# EAGLE design mainboardv0.1 (EAGLE 6.5.0)
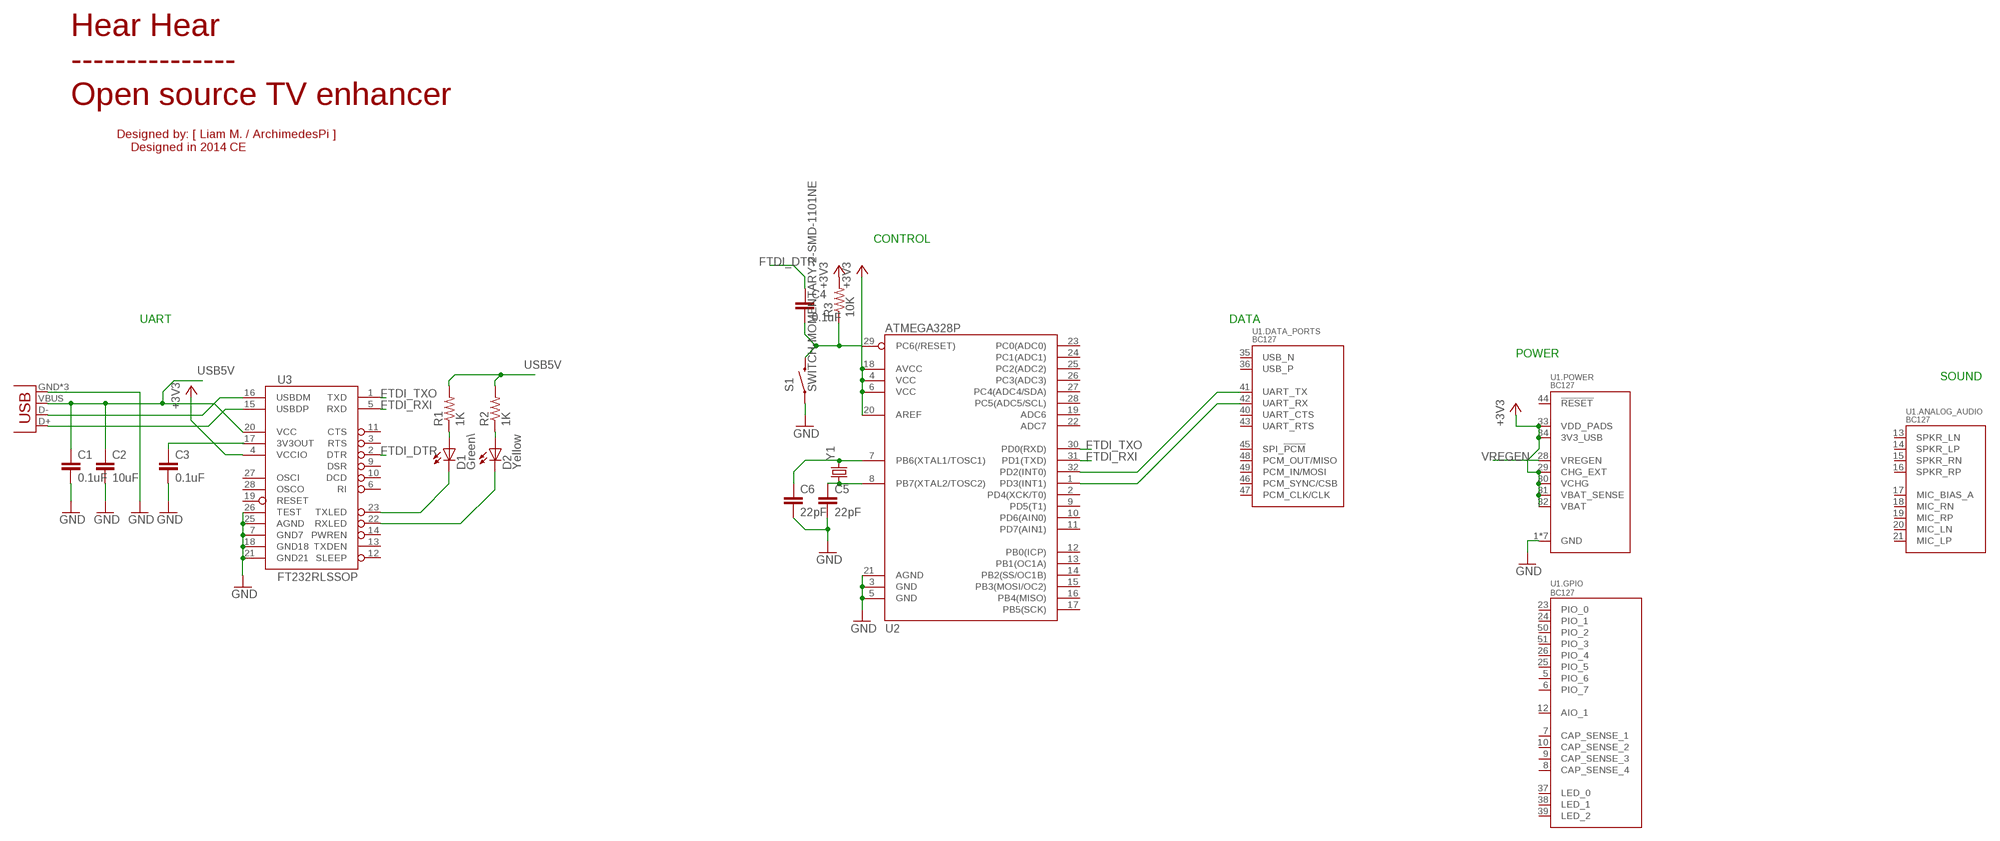
[diagram p0: schematic, sheet 1]

## Parts
C1  0.1uF  0.1UF-100V-10%(0603)  [0603-CAP]
C2  10uF  10UF-6.3V-20%(0603)  [0603-CAP]
C3  0.1uF  0.1UF-100V-10%(0603)  [0603-CAP]
C4  0.1uF  0.1UF-25V(+80/-20%)(0603)  [0603-CAP]
C5  22pF  22PF-50V-5%(0603)  [0603-CAP]
C6  22pF  22PF-50V-5%(0603)  [0603-CAP]
D1  Green\  LED-GREEN0603  [LED-0603]
D2  Yellow  LED-YELLOW0603  [LED-0603]
JP1  USB-MICROB  [USB-MICROB]
R1  1K  1KOHM1/10W1%(0603)  [0603-RES]
R2  1K  1KOHM1/10W1%(0603)  [0603-RES]
R3  10K  10KOHM1/10W1%(0603)0603  [0603-RES]
S1  SWITCH-MOMENTARY-2-SMD-1101NE  [TACTILE-SWITCH-1101NE]
U1  BC127  [BC127]
U2  ATMEGA328P  ATMEGA328_SMT  [TQFP32-08]
U3  FT232RLSSOP  [SSOP28DB]
Y1  CRYSTALHC49US  [HC49US]

## Nets
+3V3: R3.2 U1.29(.POWER:CHG_EXT) U1.30(.POWER:VCHG) U1.31(.POWER:VBAT_SENSE) U1.32(.POWER:VBAT) U1.33(.POWER:VDD_PADS) U1.34(.POWER:3V3_USB) U2.4(VCC) U2.6(VCC) U2.18(AVCC) U2.20(AREF) U3.4(VCCIO)
BC127_UART_RXI: U1.42(.DATA_PORTS:UART_RX) U2.1(PD3(INT1))
BC127_UART_TXO: U1.41(.DATA_PORTS:UART_TX) U2.32(PD2(INT0))
FTDI_DTR: C4.1 U3.2(DTR)
FTDI_RXI: U2.31(PD1(TXD)) U3.5(RXD)
FTDI_TXO: U2.30(PD0(RXD)) U3.1(TXD)
GND: C1.2 C2.2 C3.2 C5.2 C6.2 JP1.GND JP1.MT1(GND) JP1.MT2(GND) S1.P$1 U1.1(.POWER:GND) U1.2(.POWER:GND) U1.3(.POWER:GND) U1.4(.POWER:GND) U1.11(.POWER:GND) U1.22(.POWER:GND) U1.27(.POWER:GND) U2.3(GND) U2.5(GND) U2.21(AGND) U3.7(GND7) U3.18(GND18) U3.21(GND21) U3.25(AGND) U3.26(TEST)
N$1: JP1.D- U3.16(USBDM)
N$2: JP1.D+ U3.15(USBDP)
N$3: C4.2 R3.1 S1.P$2 U2.29(PC6(/RESET))
N$4: C3.1 U3.17(3V3OUT)
N$5: D1.A R1.1
N$6: D2.A R2.1
N$7: D1.C U3.23(TXLED)
N$8: D2.C U3.22(RXLED)
N$9: C6.1 U2.7(PB6(XTAL1/TOSC1)) Y1.2
N$10: C5.1 U2.8(PB7(XTAL2/TOSC2)) Y1.1
USB5V: C1.1 C2.1 JP1.VBUS R1.2 R2.2 U3.20(VCC)
VREGEN: U1.28(.POWER:VREGEN)
Unconnected: U1.5(.GPIO:PIO_6) U1.6(.GPIO:PIO_7) U1.7(.GPIO:CAP_SENSE_1) U1.8(.GPIO:CAP_SENSE_4) U1.9(.GPIO:CAP_SENSE_3) U1.10(.GPIO:CAP_SENSE_2) U1.12(.GPIO:AIO_1) U1.13(.ANALOG_AUDIO:SPKR_LN) U1.14(.ANALOG_AUDIO:SPKR_LP) U1.15(.ANALOG_AUDIO:SPKR_RN) U1.16(.ANALOG_AUDIO:SPKR_RP) U1.17(.ANALOG_AUDIO:MIC_BIAS_A) U1.18(.ANALOG_AUDIO:MIC_RN) U1.19(.ANALOG_AUDIO:MIC_RP) U1.20(.ANALOG_AUDIO:MIC_LN) U1.21(.ANALOG_AUDIO:MIC_LP) U1.23(.GPIO:PIO_0) U1.24(.GPIO:PIO_1) U1.25(.GPIO:PIO_5) U1.26(.GPIO:PIO_4) U1.35(.DATA_PORTS:USB_N) U1.36(.DATA_PORTS:USB_P) U1.37(.GPIO:LED_0) U1.38(.GPIO:LED_1) U1.39(.GPIO:LED_2) U1.40(.DATA_PORTS:UART_CTS) U1.43(.DATA_PORTS:UART_RTS) U1.44(.POWER:!RESET) U1.45(.DATA_PORTS:SPI_!PCM) U1.46(.DATA_PORTS:PCM_SYNC/CSB) U1.47(.DATA_PORTS:PCM_CLK/CLK) U1.48(.DATA_PORTS:PCM_OUT/MISO) U1.49(.DATA_PORTS:PCM_IN/MOSI) U1.50(.GPIO:PIO_2) U1.51(.GPIO:PIO_3) U2.2(PD4(XCK/T0)) U2.9(PD5(T1)) U2.10(PD6(AIN0)) U2.11(PD7(AIN1)) U2.12(PB0(ICP)) U2.13(PB1(OC1A)) U2.14(PB2(SS/OC1B)) U2.15(PB3(MOSI/OC2)) U2.16(PB4(MISO)) U2.17(PB5(SCK)) U2.19(ADC6) U2.22(ADC7) U2.23(PC0(ADC0)) U2.24(PC1(ADC1)) U2.25(PC2(ADC2)) U2.26(PC3(ADC3)) U2.27(PC4(ADC4/SDA)) U2.28(PC5(ADC5/SCL)) U3.3(RTS) U3.6(RI) U3.9(DSR) U3.10(DCD) U3.11(CTS) U3.12(SLEEP) U3.13(TXDEN) U3.14(PWREN) U3.19(RESET) U3.27(OSCI) U3.28(OSCO)

## Notes on the sheet
- Hear Hear
  ---------------
  Open source TV enhancer
- Designed by: [ Liam M. / ArchimedesPi ]
      Designed in 2014 CE
- CONTROL
- UART | DATA
- POWER
- SOUND

## Library data of the parts
C1 C3 = SparkFun-Capacitors:0.1UF-100V-10%(0603): CAP-08390; PROD_ID: CAP-08390
C2 = SparkFun-Capacitors:10UF-6.3V-20%(0603): CAP-11015; PROD_ID: CAP-11015
C4 = SparkFun-Capacitors:0.1UF-25V(+80/-20%)(0603): CAP-00810 Ceramic Standard decoupling cap; PROD_ID: CAP-00810
C5 C6 = SparkFun-Capacitors:22PF-50V-5%(0603): CAP-07876; PROD_ID: CAP-07876
D1 = SparkFun-LED:LED-GREEN: Various green LEDs Green LEDs used in SFE Production 0603- DIO-00821 LARGE- DIO-00862 LILYPAD- DIO-09910; PROD_ID: DIO-00821; VALUE: GREEN
D2 = SparkFun-LED:LED-YELLOW: Yellow SMD LEDs LilyPad 1206- DIO-09909 0603- DIO-09003; PROD_ID: DIO-09003
JP1 = SparkFun-Connectors:USB: USB Connectors USB-B-PTH is fully proven SKU : PRT-00139/CONN-08278 USB-miniB is fully proven SKU : PRT-00587 USB-A-PCB is untested. USB-A-H is throughly reviewed, but untested. Spark Fun Electronics SKU : PRT-00437 USB-B-SMT is throughly reviewed, but untested. Needs silkscreen touching up. USB-A-S has not been used/tested USB-MB-H has not been used/tested USB-MICROB has been used. CONN-09505; PROD_ID: CONN-09505
R1 R2 = SparkFun-Resistors:1KOHM1/10W1%(0603): RES-07856; PROD_ID: RES-07856
R3 = SparkFun-Resistors:10KOHM1/10W1%(0603): RES-00824; PROD_ID: RES-00824
S1 = SparkFun-Electromechanical:SWITCH-MOMENTARY-2: Various NO switches- pushbuttons, reed, etc
U1 = SparkFun-RF:BC127: Blue Creations BC127 BLE module Hyper-competent Bluetooth 4.0 module, with: - Pre-4.0 support - 4 Cap sense inputs - 1 Analog input - 8 GPIO - 3 Open-drain LED drivers - Onboard battery charge circuitry - SPP/UART support - PCM Audio support - SPI port - Built-in USB - All kinds of other crazy crap
U2 = SparkFun-DigitalIC:ATMEGA328_SMT: 32-Pin Atmega328 part Commonly used on Arduino compatible boards Available in QFP and QFN packages TQFP is IC-09069 QFN is non-stock; PROD_ID: IC-09069
U3 = SparkFun-DigitalIC:FT232RL: USB UART FT232RL 4th Generation USB UART (USB <-> Serial) Controller. Spark Fun Electronics SKU : COM-00650 Production SKU IC-00870; PROD_ID: IC-00870
Y1 = SparkFun-FreqCtrl:CRYSTAL: Various standard crystals. Proven footprints. Spark Fun Electronics SKU : COM-00534

## Board
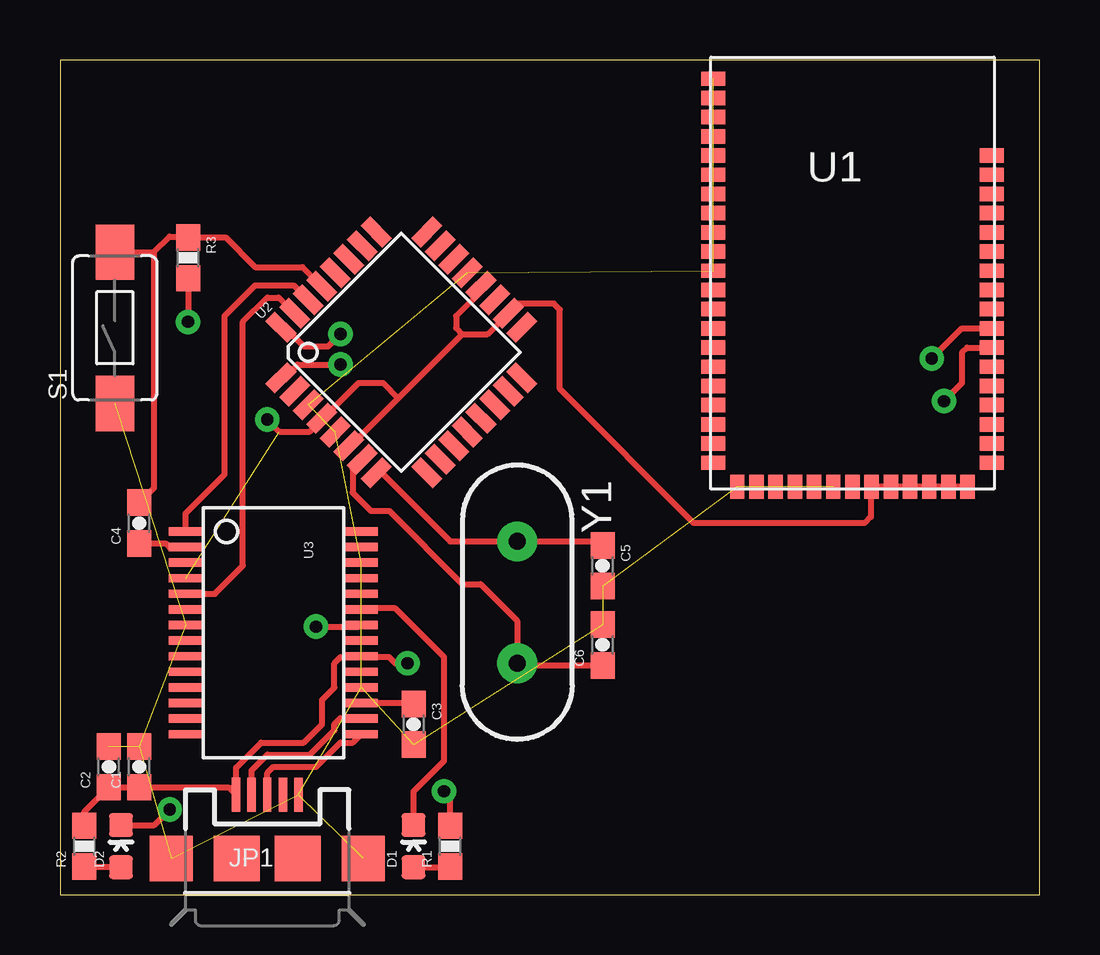
[diagram p1: board, top side]
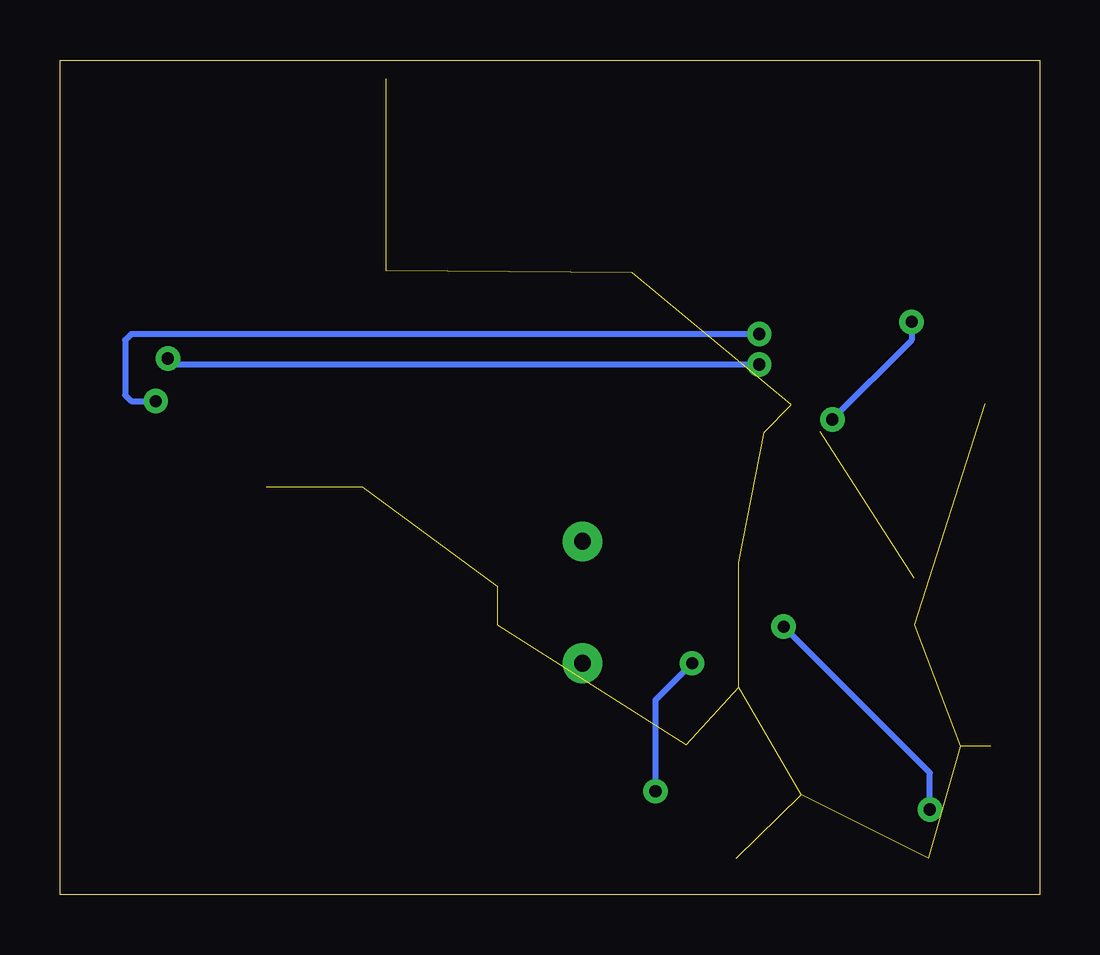
[diagram p2: board, bottom side, seen from below]

Size 40.82 x 34.79 mm. Coordinates in mm from the lower left corner, seen from the top.
Outline: 0,0 40.82,0 40.82,34.79 0,34.79 0,0
Copper layers (1*16): Top 0.035mm / dielectric 1.5mm / Bottom 0.035mm
Design rules "SparkFun-2-layer": minimum track width 7mil, minimum drill 15mil, track to track 8mil, track to pad 8mil, pad to pad 8mil, via to via 8mil, smd to smd 8mil, copper to edge 8mil, drill to drill 8mil, minimum pad ring 12mil, minimum via ring 10mil, stop-mask expansion 4mil, vias tented up to drill 20mil, thermal gap 10mil

### Footprints (pad centres in the part's own frame; a part is rotated, then mirrored left to right if it is on the bottom)
0603-CAP = smd 1.1 x 1: 1 -0.85,0; 2 0.85,0
LED-0603 = smd 1 x 1: A 0,-0.877; C 0,0.877
USB-MICROB = smd 0.35 x 1.4: D+ 0,2.65; D- -0.65,2.65; GND 1.3,2.65; ID 0.65,2.65; VBUS -1.3,2.65 | smd 1.8 x 1.9: MT1 -4,0; MT2 4,0 | smd 1.9 x 1.9: P$1 -1.27,0; P$2 1.27,0
0603-RES = smd 1.1 x 1: 1 -0.85,0; 2 0.85,0
TACTILE-SWITCH-1101NE = smd 2.3 x 1.6: P$1 -3.15,0; P$2 3.15,0
BC127 = smd 1 x 0.6: 1 -5.8,8.1; 2 -5.8,7.3; 3 -5.8,6.5; 4 -5.8,5.7; 5 -5.8,4.9; 6 -5.8,4.1; 7 -5.8,3.3; 8 -5.8,2.5; 9 -5.8,1.7; 10 -5.8,0.9; 11 -5.8,0.1; 12 -5.8,-0.7; 13 -5.8,-1.5; 14 -5.8,-2.3; 15 -5.8,-3.1; 16 -5.8,-3.9; 17 -5.8,-4.7; 18 -5.8,-5.5; 19 -5.8,-6.3; 20 -5.8,-7.1; 21 -5.8,-7.9; 35 5.8,-7.9; 36 5.8,-7.1; 37 5.8,-6.3; 38 5.8,-5.5; 39 5.8,-4.7; 40 5.8,-3.9; 41 5.8,-3.1; 42 5.8,-2.3; 43 5.8,-1.5; 44 5.8,-0.7; 45 5.8,0.1; 46 5.8,0.9; 47 5.8,1.7; 48 5.8,2.5; 49 5.8,3.3; 50 5.8,4.1; 51 5.8,4.9 | smd 0.6 x 1: 22 -4.8,-8.9; 23 -4,-8.9; 24 -3.2,-8.9; 25 -2.4,-8.9; 26 -1.6,-8.9; 27 -0.8,-8.9; 28 0,-8.9; 29 0.8,-8.9; 30 1.6,-8.9; 31 2.4,-8.9; 32 3.2,-8.9; 33 4,-8.9; 34 4.8,-8.9
TQFP32-08 = smd 1.27 x 0.559: 1 -4.293,2.8; 2 -4.293,2; 3 -4.293,1.2; 4 -4.293,0.4; 5 -4.293,-0.4; 6 -4.293,-1.2; 7 -4.293,-2; 8 -4.293,-2.8; 17 4.293,-2.8; 18 4.293,-2; 19 4.293,-1.2; 20 4.293,-0.4; 21 4.293,0.4; 22 4.293,1.2; 23 4.293,2; 24 4.293,2.8 | smd 0.559 x 1.27: 9 -2.8,-4.293; 10 -2,-4.293; 11 -1.2,-4.293; 12 -0.4,-4.293; 13 0.4,-4.293; 14 1.2,-4.293; 15 2,-4.293; 16 2.8,-4.293; 25 2.8,4.293; 26 2,4.293; 27 1.2,4.293; 28 0.4,4.293; 29 -0.4,4.293; 30 -1.2,4.293; 31 -2,4.293; 32 -2.8,4.293
SSOP28DB = smd 0.348 x 1.397: 1 -4.225,-3.656; 2 -3.575,-3.656; 3 -2.925,-3.656; 4 -2.275,-3.656; 5 -1.625,-3.656; 6 -0.975,-3.656; 7 -0.325,-3.656; 8 0.325,-3.656; 9 0.975,-3.656; 10 1.625,-3.656; 11 2.275,-3.656; 12 2.925,-3.656; 13 3.575,-3.656; 14 4.225,-3.656; 15 4.225,3.656; 16 3.575,3.656; 17 2.925,3.656; 18 2.275,3.656; 19 1.625,3.656; 20 0.975,3.656; 21 0.325,3.656; 22 -0.325,3.656; 23 -0.975,3.656; 24 -1.625,3.656; 25 -2.275,3.656; 26 -2.925,3.656; 27 -3.575,3.656; 28 -4.225,3.656
HC49US = drill 0.7 pad 1.651: 1 -2.54,0; 2 2.54,0

### Placement (x,y rotation side)
C1  3.3,5.33 90 top
C2  2.03,5.33 90 top
C3  14.73,7.11 270 top
C4  3.3,15.49 90 top
C5  22.61,13.72 270 top
C6  22.61,10.41 90 top
D1  14.73,2.03 0 top
D2  2.54,2.03 0 top
JP1  8.64,1.52 0 top
R1  16.26,2.03 90 top
R2  1.02,2.03 90 top
R3  5.33,26.54 270 top
S1  2.29,23.62 90 top
U1  33.02,25.91 0 top
U2  14.22,22.61 45 top
U3  8.89,10.92 270 top
Y1  19.05,12.19 270 top

### Tracks (layer width: path | path; a pad name or v marks a point on that pad's centre or on a via)
+3V3  (via drill 0.51)  (1 unrouted)
  Top 0.254: U1.34 U1.33 U1.32 U1.31 U1.30 U1.29 33.78,16.97 33.78,15.75 33.53,15.49 26.42,15.49 20.83,21.08 20.83,24.38 20.57,24.64 19.05,24.64 18.67,24.26 U2.18 17.81,23.37 16.76,23.37 | U2.6 12.12,18.72 14.1,20.7 | 14.1,20.7 16.76,23.37 | U2.20 17.54,25.16 16.51,24.13 16.51,23.62 16.76,23.37 | 14.1,20.7 13.46,21.34 12.45,21.34 10.96,19.85 U2.4 10.91,19.8 10.41,19.3 9.14,19.3 v8.64,19.81 | R3.2 v5.33,23.88
  Bottom 0.254: v5.33,23.88 5.33,23.11 v8.64,19.81
BC127_UART_RXI  (via drill 0.51)
  Top 0.254: U2.1 9.36,21.55 9.91,22.1 v11.68,22.1 | v36.32,22.35 37.58,23.61 U1.42
  Bottom 0.254: v11.68,22.1 36.07,22.1 v36.32,22.35
BC127_UART_TXO  (via drill 0.51)
  Top 0.254: U2.32 9.36,23.66 10.16,22.86 11.18,22.86 v11.68,23.37 | v36.83,20.57 37.59,21.34 37.59,22.61 37.79,22.81 U1.41
  Bottom 0.254: v11.68,23.37 37.85,23.37 38.1,23.11 38.1,20.83 37.85,20.57 v36.83,20.57
FTDI_DTR
  Top 0.254: C4.1 4.41,14.64 4.57,14.48 5.21,14.48 U3.2
FTDI_RXI
  Top 0.254: U3.5 6.45,12.55 7.62,13.72 7.62,23.88 8.64,24.89 9.11,24.89 U2.31
FTDI_TXO
  Top 0.254: U3.1 5.23,15.9 6.86,17.53 6.86,24.13 8.13,25.4 9.73,25.4 U2.30
GND  (23 unrouted)
N$1
  Top 0.254: JP1.D- 7.99,5.19 8.64,5.84 10.41,5.84 11.43,6.86 11.43,7.11 11.68,7.37 12.53,7.37 U3.16
N$2
  Top 0.254: JP1.D+ 8.64,5.08 8.89,5.33 10.67,5.33 11.68,6.35 12.2,6.35 U3.15
N$3
  Top 0.254: S1.P$2 3.91,26.77 | 3.91,26.77 4.57,27.43 5.29,27.43 R3.1 6.9,27.39 8.13,26.16 10.1,26.16 U2.29 | 3.91,26.77 3.91,16.95 C4.2
N$4
  Top 0.254: U3.17 14.7,8 C3.1
N$5
  Top 0.254: D1.A 16.23,1.16 R1.1
N$6
  Top 0.254: R2.1 2.51,1.18 D2.A
N$7
  Top 0.254: D1.C 14.73,4.32 16,5.59 16,9.91 13.97,11.94 12.59,11.94 U3.23
N$8  (via drill 0.51)
  Top 0.254: D2.C 3.92,2.91 v4.57,3.56 | v10.67,11.18 12.47,11.18 U3.22
  Bottom 0.254: v4.57,3.56 4.57,5.08 v10.67,11.18
N$9
  Top 0.254: U2.7 12.19,17.75 12.19,16.76 12.95,16 13.72,16 16.76,12.95 17.53,12.95 19.05,11.43 Y1.2 19.14,9.56 C6.1
N$10
  Top 0.254: U2.8 13.4,17.59 16.26,14.73 Y1.1 22.44,14.73 C5.1
USB5V  (via drill 0.51)
  Top 0.254: R2.2 1.02,3.47 C2.1 C1.1 7.03,4.48 JP1.VBUS 7.34,5.3 8.38,6.35 10.16,6.35 10.92,7.11 10.92,8.13 11.43,8.64 11.43,9.65 11.68,9.91 12.51,9.91 U3.20 12.59,9.91 13.72,9.91 13.97,9.65 v14.48,9.65 | R1.2 16.26,4.06 v16,4.32
  Bottom 0.254: v16,4.32 16,8.13 v14.48,9.65